# Altium schematic sheet stm8s103_sim900a.SchDoc
size 508 x 304 mm
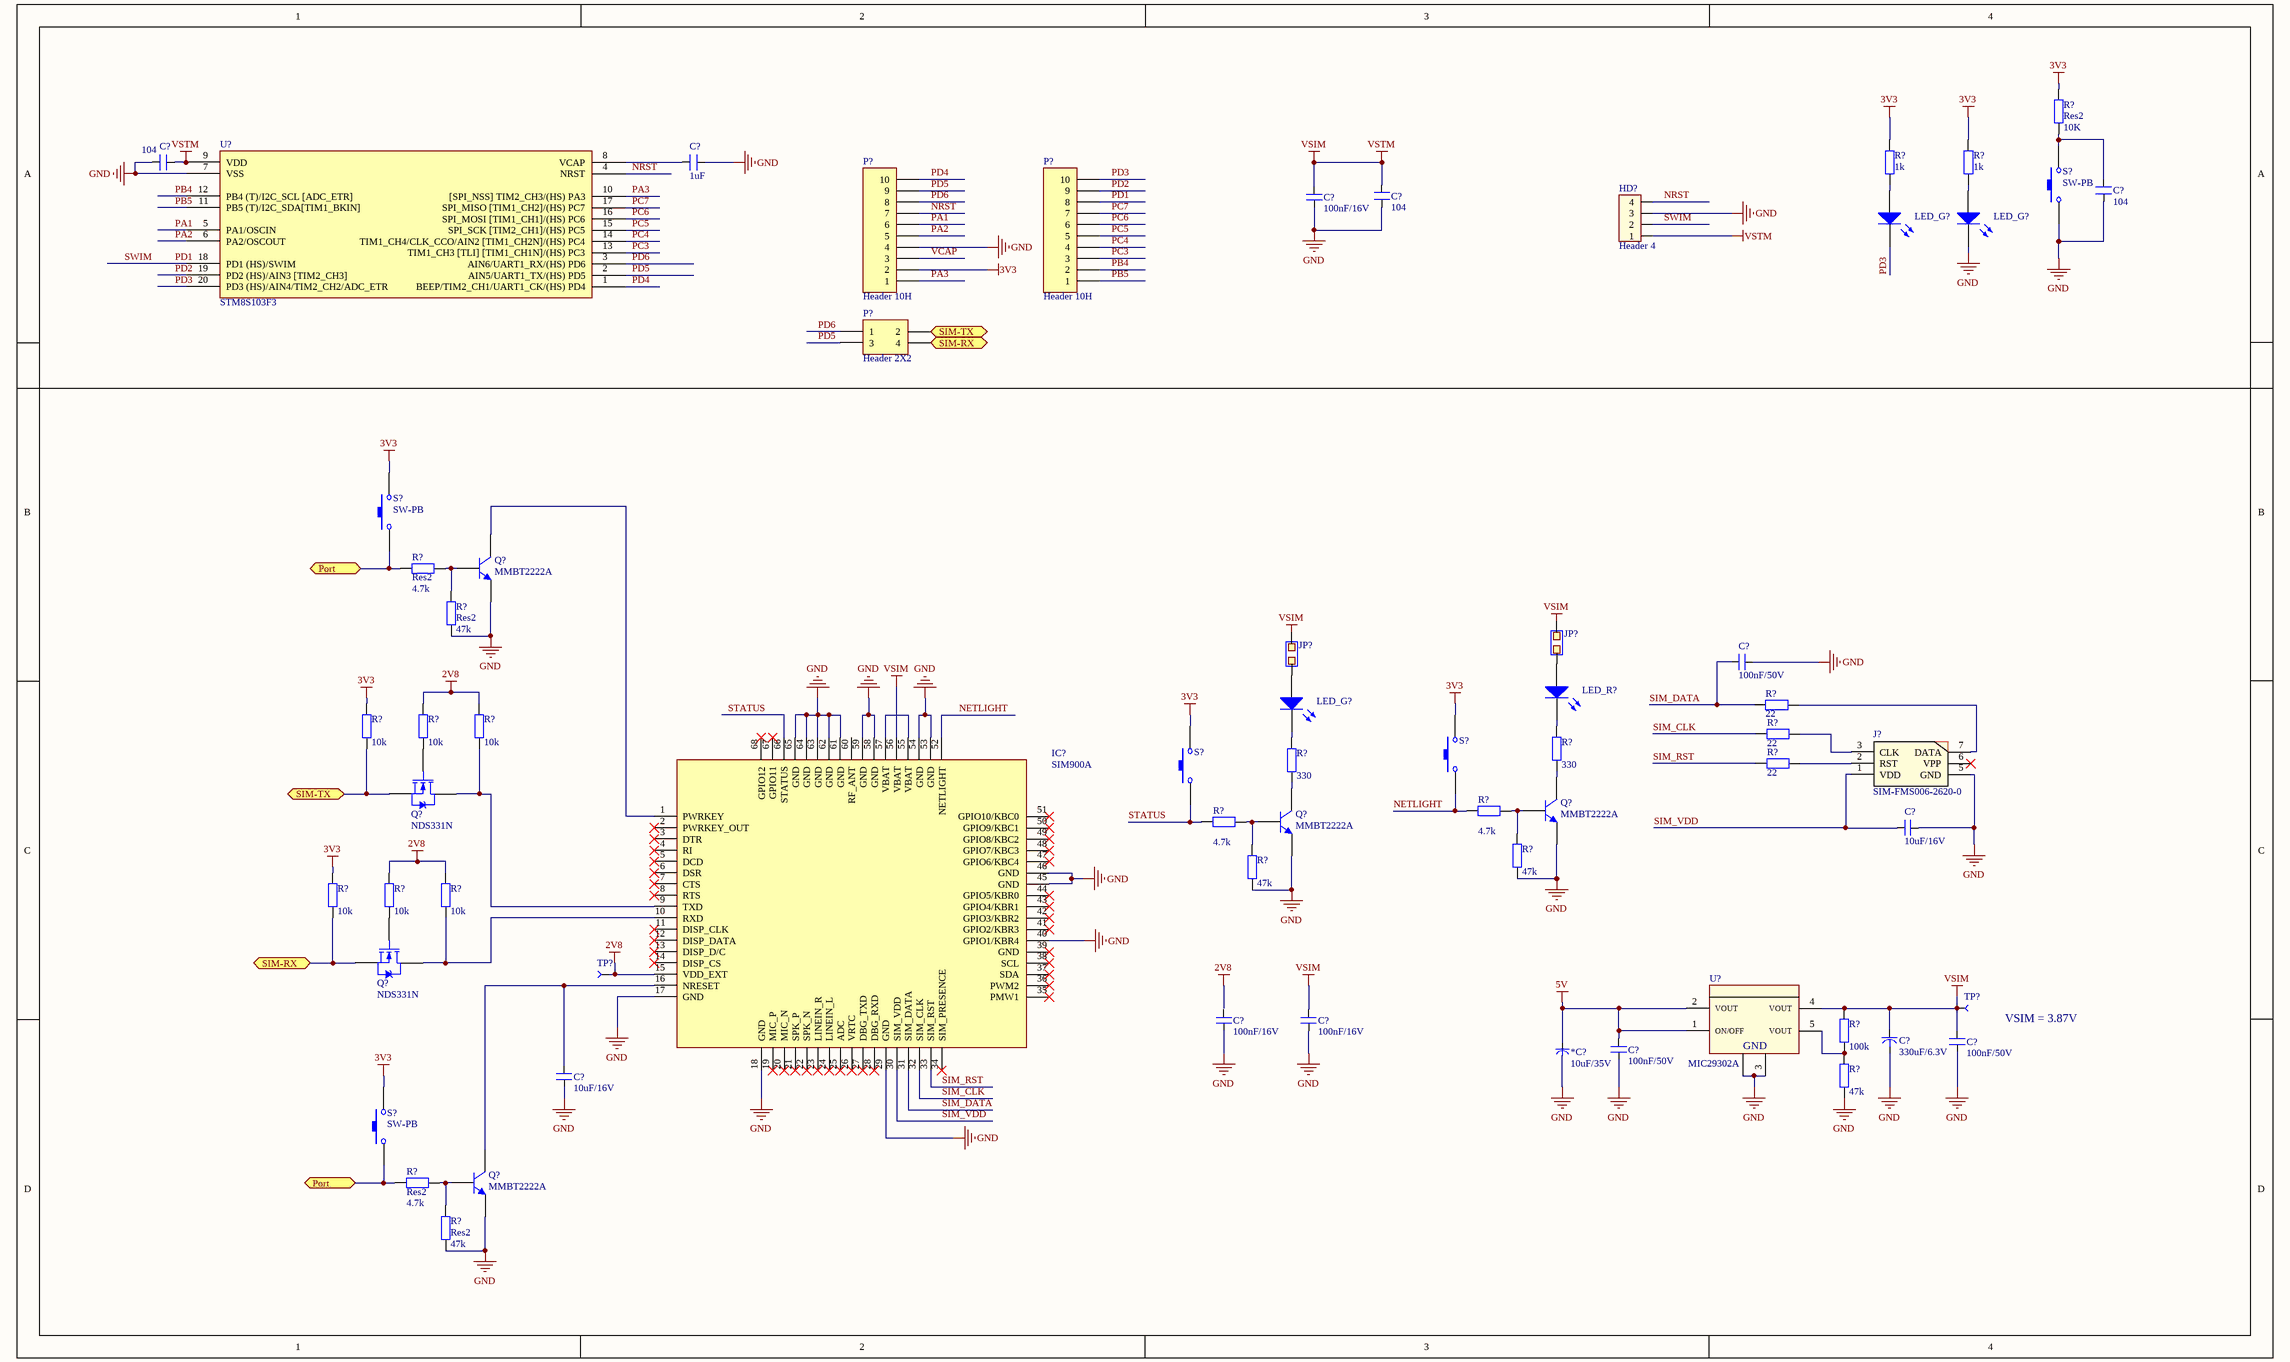
[diagram p0: stm8s103_sim900a.SchDoc]

## Parts
(Parts that share a designator on the sheet are numbered #1, #2 ... from top to bottom, then left to right.)
*C?  10uF/35V
C?#1  104  [CN2]
C?#2  1uF  [CN2]
C?#3  104  [CN2]
C?#4  104  [CN2]
C?#5  100nF/16V
C?#6  100nF/50V
C?#7  10uF/16V
C?#8  100nF/16V
C?#9  100nF/16V
C?#10  330uF/6.3V
C?#11  100nF/50V
C?#12  100nF/50V
C?#13  10uF/16V
HD?  Header 4  [HED4]
IC?  SIM900A
J?  SIM-FMS006-2620-0
JP?#1  JP2  (value not drawn)
JP?#2  JP2  (value not drawn)
LED_G?#1  LED_G  [LED-0]  (value not drawn)
LED_G?#2  LED_G  [LED-0]  (value not drawn)
LED_G?#3  LED_G  [LED-0]  (value not drawn)
LED_R?  LED_R  [LED-0]  (value not drawn)
P?#1  Header 10H  [HDR1X10H]
P?#2  Header 10H  [HDR1X10H]
P?#3  Header 2X2  [HDR2X2]
Q?#1  MMBT2222A  [TO-92A]
Q?#2  NDS331N  [TO-220AB]
Q?#3  MMBT2222A  [TO-92A]
Q?#4  MMBT2222A  [TO-92A]
Q?#5  NDS331N  [TO-220AB]
Q?#6  MMBT2222A  [TO-92A]
R?#1  Res2  value 10K  [AXIAL-0.4]
R?#2  value 1k  [AXIAL-0.4]  (hidden comment: Res2)
R?#3  value 1k  [AXIAL-0.4]  (hidden comment: Res2)
R?#4  Res2  value 4.7k  [AXIAL-0.4]
R?#5  Res2  value 47k  [AXIAL-0.4]
R?#6  value 10k  [AXIAL-0.4]  (hidden comment: Res2)
R?#7  value 22  [AXIAL-0.4]  (hidden comment: Res2)
R?#8  value 10k  [AXIAL-0.4]  (hidden comment: Res2)
R?#9  value 10k  [AXIAL-0.4]  (hidden comment: Res2)
R?#10  value 22  [AXIAL-0.4]  (hidden comment: Res2)
R?#11  value 330  [AXIAL-0.4]  (hidden comment: Res2)
R?#12  value 330  [AXIAL-0.4]  (hidden comment: Res2)
R?#13  value 22  [AXIAL-0.4]  (hidden comment: Res2)
R?#14  value 4.7k  [AXIAL-0.4]  (hidden comment: Res2)
R?#15  value 4.7k  [AXIAL-0.4]  (hidden comment: Res2)
R?#16  value 47k  [AXIAL-0.4]  (hidden comment: Res2)
R?#17  value 47k  [AXIAL-0.4]  (hidden comment: Res2)
R?#18  value 10k  [AXIAL-0.4]  (hidden comment: Res2)
R?#19  value 10k  [AXIAL-0.4]  (hidden comment: Res2)
R?#20  value 10k  [AXIAL-0.4]  (hidden comment: Res2)
R?#21  value 100k  [AXIAL-0.4]  (hidden comment: Res2)
R?#22  value 47k  [AXIAL-0.4]  (hidden comment: Res2)
R?#23  Res2  value 4.7k  [AXIAL-0.4]
R?#24  Res2  value 47k  [AXIAL-0.4]
S?#1  SW-PB  [SPST-2]
S?#2  SW-PB  [SPST-2]
S?#3  SW-PB  [SPST-2]  (value not drawn)
S?#4  SW-PB  [SPST-2]  (value not drawn)
S?#5  SW-PB  [SPST-2]
TP?#1  TP  (value not drawn)
TP?#2  TP  (value not drawn)
U?#1  STM8S103F3
U?#2  MIC29302A

## Ports
Port (bidir), SIM-RX (bidir), SIM-TX (bidir)

## Nets
2V8: IC?.15(VDD_EXT) R?#8.2 R?#9.2 R?#19.2 R?#20.2 TP?#1.1
3V3: P?#1.2 R?#1.2 R?#2.2 R?#3.2 R?#6.1 R?#18.1 S?#2.2 S?#3.2 S?#4.2 S?#5.2
5V: C?#12.1 U?#2.1(ON/OFF) U?#2.2(VOUT)
GND: *C?.2 C?#1.2 C?#2.1 C?#3.2 C?#4.2 C?#5.2 C?#6.2 C?#7.2 C?#8.2 C?#9.2 C?#10.2 C?#11.2 C?#12.2 C?#13.2 HD?.3 IC?.17(GND) IC?.18(GND) IC?.29(GND) IC?.40(GPIO1/KBR4) IC?.45(GND) IC?.46(GND) IC?.53(GND) IC?.54(GND) IC?.58(GND) IC?.59(GND) IC?.61(GND) IC?.62(GND) IC?.63(GND) IC?.64(GND) IC?.65(GND) J?.5(GND) LED_G?#2.2(K) P?#1.4 Q?#1.1(E) Q?#3.1(E) Q?#4.1(E) Q?#6.1(E) R?#5.1 R?#16.1 R?#17.1 R?#22.1 R?#24.1 S?#1.1 U?#1.7(VSS) U?#2.3(GND) U?#2.6(TAB)
VSIM: C?#1.1 C?#4.1 C?#5.1 C?#9.1 C?#10.1 C?#11.1 HD?.1 IC?.56(VBAT) R?#21.2 TP?#2.1 U?#1.9(VDD) U?#2.4(VOUT)  [also labelled VSTM]
NETLIGHT: IC?.52(NETLIGHT) R?#14.1 S?#3.1
NRST: HD?.4 P?#1.7 U?#1.4(NRST)
PA1: P?#1.6 U?#1.5(PA1/OSCIN)
PA2: P?#1.5 U?#1.6(PA2/OSCOUT)
PA3: P?#1.1 U?#1.10([SPI_NSS]_TIM2_CH3/(HS)_PA3)
PB4: P?#2.2 U?#1.12(PB4_(T)/I2C_SCL_[ADC_ETR])
PB5: P?#2.1 U?#1.11(PB5_(T)/I2C_SDA[TIM1_BKIN])
PC3: P?#2.3 U?#1.13(TIM1_CH3_[TLI]_[TIM1_CH1N]/(HS)_PC3)
PC4: P?#2.4 U?#1.14(TIM1_CH4/CLK_CCO/AIN2_[TIM1_CH2N]/(HS)_PC4)
PC5: P?#2.5 U?#1.15(SPI_SCK_[TIM2_CH1]/(HS)_PC5)
PC6: P?#2.6 U?#1.16(SPI_MOSI_[TIM1_CH1]/(HS)_PC6)
PC7: P?#2.7 U?#1.17(SPI_MISO_[TIM1_CH2]/(HS)_PC7)
PD1: HD?.2 P?#2.8 U?#1.18(PD1_(HS)/SWIM)  [also labelled SWIM]
PD2: P?#2.9 U?#1.19(PD2_(HS)/AIN3_[TIM2_CH3])
PD3: LED_G?#1.2(K) P?#2.10 U?#1.20(PD3_(HS)/AIN4/TIM2_CH2/ADC_ETR)
PD4: P?#1.10 U?#1.1(BEEP/TIM2_CH1/UART1_CK/(HS)_PD4)
PD5: P?#1.9 P?#3.3 U?#1.2(AIN5/UART1_TX/(HS)_PD5)
PD6: P?#1.8 P?#3.1 U?#1.3(AIN6/UART1_RX/(HS)_PD6)
Port: R?#4.1 R?#23.1 S?#2.1 S?#5.1 ; port Port
SIM-RX: P?#3.4 Q?#5.3(S) R?#18.2 ; port SIM-RX
SIM-TX: P?#3.2 Q?#2.3(S) R?#6.2 ; port SIM-TX
SIM_CLK: IC?.32(SIM_CLK) R?#10.2
SIM_DATA: C?#6.1 IC?.31(SIM_DATA) R?#7.2
SIM_RST: IC?.33(SIM_RST) R?#13.2
SIM_VDD: C?#7.1 IC?.30(SIM_VDD) J?.1(VDD)
STATUS: IC?.66(STATUS) R?#15.1 S?#4.1
VCAP: P?#1.3
NetC?#2_2: C?#2.2 U?#1.8(VCAP)
NetC?#3_1: C?#3.1 R?#1.1 S?#1.2
NetC?#13_1: C?#13.1 IC?.16(NRESET) Q?#6.3(C)
NetIC?_1: IC?.1(PWRKEY) Q?#1.3(C)
NetIC?_9: IC?.9(TXD) Q?#2.2(D) R?#9.1
NetIC?_10: IC?.10(RXD) Q?#5.2(D) R?#20.1
NetIC?_55: IC?.55(VBAT) IC?.57(VBAT)
NetJ?_2: J?.2(RST) R?#13.1
NetJ?_3: J?.3(CLK) R?#10.1
NetJ?_7: J?.7(DATA) R?#7.1
NetJP?#1_2: JP?#1.2 LED_R?.1(A)
NetJP?#2_2: JP?#2.2 LED_G?#3.1(A)
NetLED_G?#1_1: LED_G?#1.1(A) R?#2.1
NetLED_G?#2_1: LED_G?#2.1(A) R?#3.1
NetLED_G?#3_2: LED_G?#3.2(K) R?#12.2
NetLED_R?_2: LED_R?.2(K) R?#11.2
NetQ?#1_2: Q?#1.2(B) R?#4.2 R?#5.2
NetQ?#2_1: Q?#2.1(G) R?#8.1
NetQ?#3_2: Q?#3.2(B) R?#14.2 R?#16.2
NetQ?#3_3: Q?#3.3(C) R?#11.1
NetQ?#4_2: Q?#4.2(B) R?#15.2 R?#17.2
NetQ?#4_3: Q?#4.3(C) R?#12.1
NetQ?#5_1: Q?#5.1(G) R?#19.1
NetQ?#6_2: Q?#6.2(B) R?#23.2 R?#24.2
NetR?#21_1: R?#21.1 R?#22.2 U?#2.5(VOUT)

Not connected (* = marked no-connect by the designer): *C? 1; C?#8 1; IC? 2(PWRKEY_OUT)* 3(DTR)* 4(RI)* 5(DCD)* 6(DSR)* 7(CTS)* 8(RTS)* 11(DISP_CLK)* 12(DISP_DATA)* 13(DISP_D/C)* 14(DISP_CS)* 19(MIC_P)* 20(MIC_N)* 21(SPK_P)* 22(SPK_N)* 23(LINEIN_R)* 24(LINEIN_L)* 25(ADC)* 26(VRTC)* 27(DBG_TXD)* 28(DBG_RXD)* 34(SIM_PRESENCE)* 35(PMW1)* 36(PWM2)* 37(SDA)* 38(SCL)* 39(GND)* 41(GPIO2/KBR3)* 42(GPIO3/KBR2)* 43(GPIO4/KBR1)* 44(GPIO5/KBR0)* 47(GPIO6/KBC4)* 48(GPIO7/KBC3)* 49(GPIO8/KBC2)* 50(GPIO9/KBC1)* 51(GPIO10/KBC0)* 60(RF_ANT) 67(GPIO11)* 68(GPIO12)*; J? 6(VPP)*; JP?#1 1; JP?#2 1

## Notes on the sheet
- VSIM = 3.87V
- Labels drawn without touching a wire or pin: VSIM
- Title
- Size:
- Date:
- File:
- A2
- Number:
- Time:
- Revision:
- Sheet
- of

## Library data of the parts
*C? = CAP-POL/10uF/35V/2413: CAP TANT 10UF 35V 10% 2413
C?#1-C?#4 = CN2: Cap np 104 => 105pF; Value: 0.1uF
C?#5-C?#9 C?#11-C?#13 = CAP/100nF/50V
C?#10 = CAP-POL/330uF/6.3V/3528: CAP TAN 330UF 20% 6V 3528-21
HD? = Hed4: Header 4 (Green); Value: Header 4
LED_G?#1-LED_G?#3 LED_R? = LED0: Typical INFRARED GaAs LED; Published: 8-Jun-2000; LatestRevisionDate: 08-Jul-2005; LatestRevisionNote: Mech Layer 1 removed.; PackageReference: LED-0; Publisher: Altium Limited; PackageDescription: LED; 2 Leads
P?#1 P?#2 = Header 10H: Header, 10-Pin, Right Angle; LatestRevisionDate: 17-Jul-2002; LatestRevisionNote: Re-released for DXP Platform.; Publisher: Altium Limited
P?#3 = Header 2X2: Header, 2-Pin, Dual row; LatestRevisionDate: 17-Jul-2002; LatestRevisionNote: Re-released for DXP Platform.; Publisher: Altium Limited
Q?#1 Q?#3 Q?#4 Q?#6 = 2N3904: NPN General Purpose Amplifier; Published: 8-Jun-2000; LatestRevisionDate: 15-Jan-2003; LatestRevisionNote: PCB Footprint 'BCY-W3/D4.7' replaced; DatasheetVersion: 1997; PackageVersion: Sep-1998; PackageReference: TO-92A; Publisher: Altium Limited; PackageDescription: TO, Flat Index; 3 In-Line, Axial Leads; Body Dia. 4.5mm; Leads 0.51 x 0.48 mm (max); ComponentLink1Description: Manufacturer Link; ComponentLink1URL: http://www.fairchildsemi.com/; ComponentLink2Description: Datasheet; ComponentLink2URL: http://www.fairchildsemi.com/ds/2N%2F2N3904.pdf
Q?#2 Q?#5 = NMOS-2: N-Channel Power MOSFET; Note: Pin 2 is electrically connected to pin 4.; Published: 8-Jun-2000; LatestRevisionDate: 17-Jul-2002; LatestRevisionNote: Re-released for DXP Platform.; DatasheetVersion: PD-9.814; PackageVersion: Feb-1997; PackageReference: TO-220AB; Publisher: Altium Limited; PackageDescription: TO, Thru-Hole, Vertical, Heatsink Mounted; 3 In-Line Leads; Pitch 2.54 mm; ComponentLink1Description: Manufacturer Link; ComponentLink1URL: http://www.irf.com/
R?#1-R?#6 R?#8 R?#9 R?#11 R?#12 R?#14-R?#20 R?#23 R?#24 = Res2: Resistor; Published: 8-Jun-2000; LatestRevisionDate: 17-Jul-2002; LatestRevisionNote: Re-released for DXP Platform.; PackageReference: AXIAL-0.4; Publisher: Altium Limited; PackageDescription: Axial Device, Thru-Hole; 2 Leads; 0.4 in Pin Spacing
R?#7 R?#10 R?#13 R?#21 R?#22 = Res2: 0605 RES; Published: 8-Jun-2000; LatestRevisionDate: 17-Jul-2002; LatestRevisionNote: Re-released for DXP Platform.; PackageReference: AXIAL-0.4; Publisher: Altium Limited; PackageDescription: Axial Device, Thru-Hole; 2 Leads; 0.4 in Pin Spacing
S?#1-S?#5 = SW-PB: Switch; Published: 24-Mar-1999; LatestRevisionDate: 17-Jul-2002; LatestRevisionNote: Re-released for DXP Platform.; PackageReference: SPST-2; Publisher: Altium Limited; PackageDescription: Switch; 2 Leads
TP?#1 TP?#2 = TP: Test point ( Via, pad )